# EAGLE schematic axiom_beta_plugin_module_TE0714_SDI_v0.10 (EAGLE 7.7.0)
Assembly variants: Beta, Min

## Sheet 1 of 6
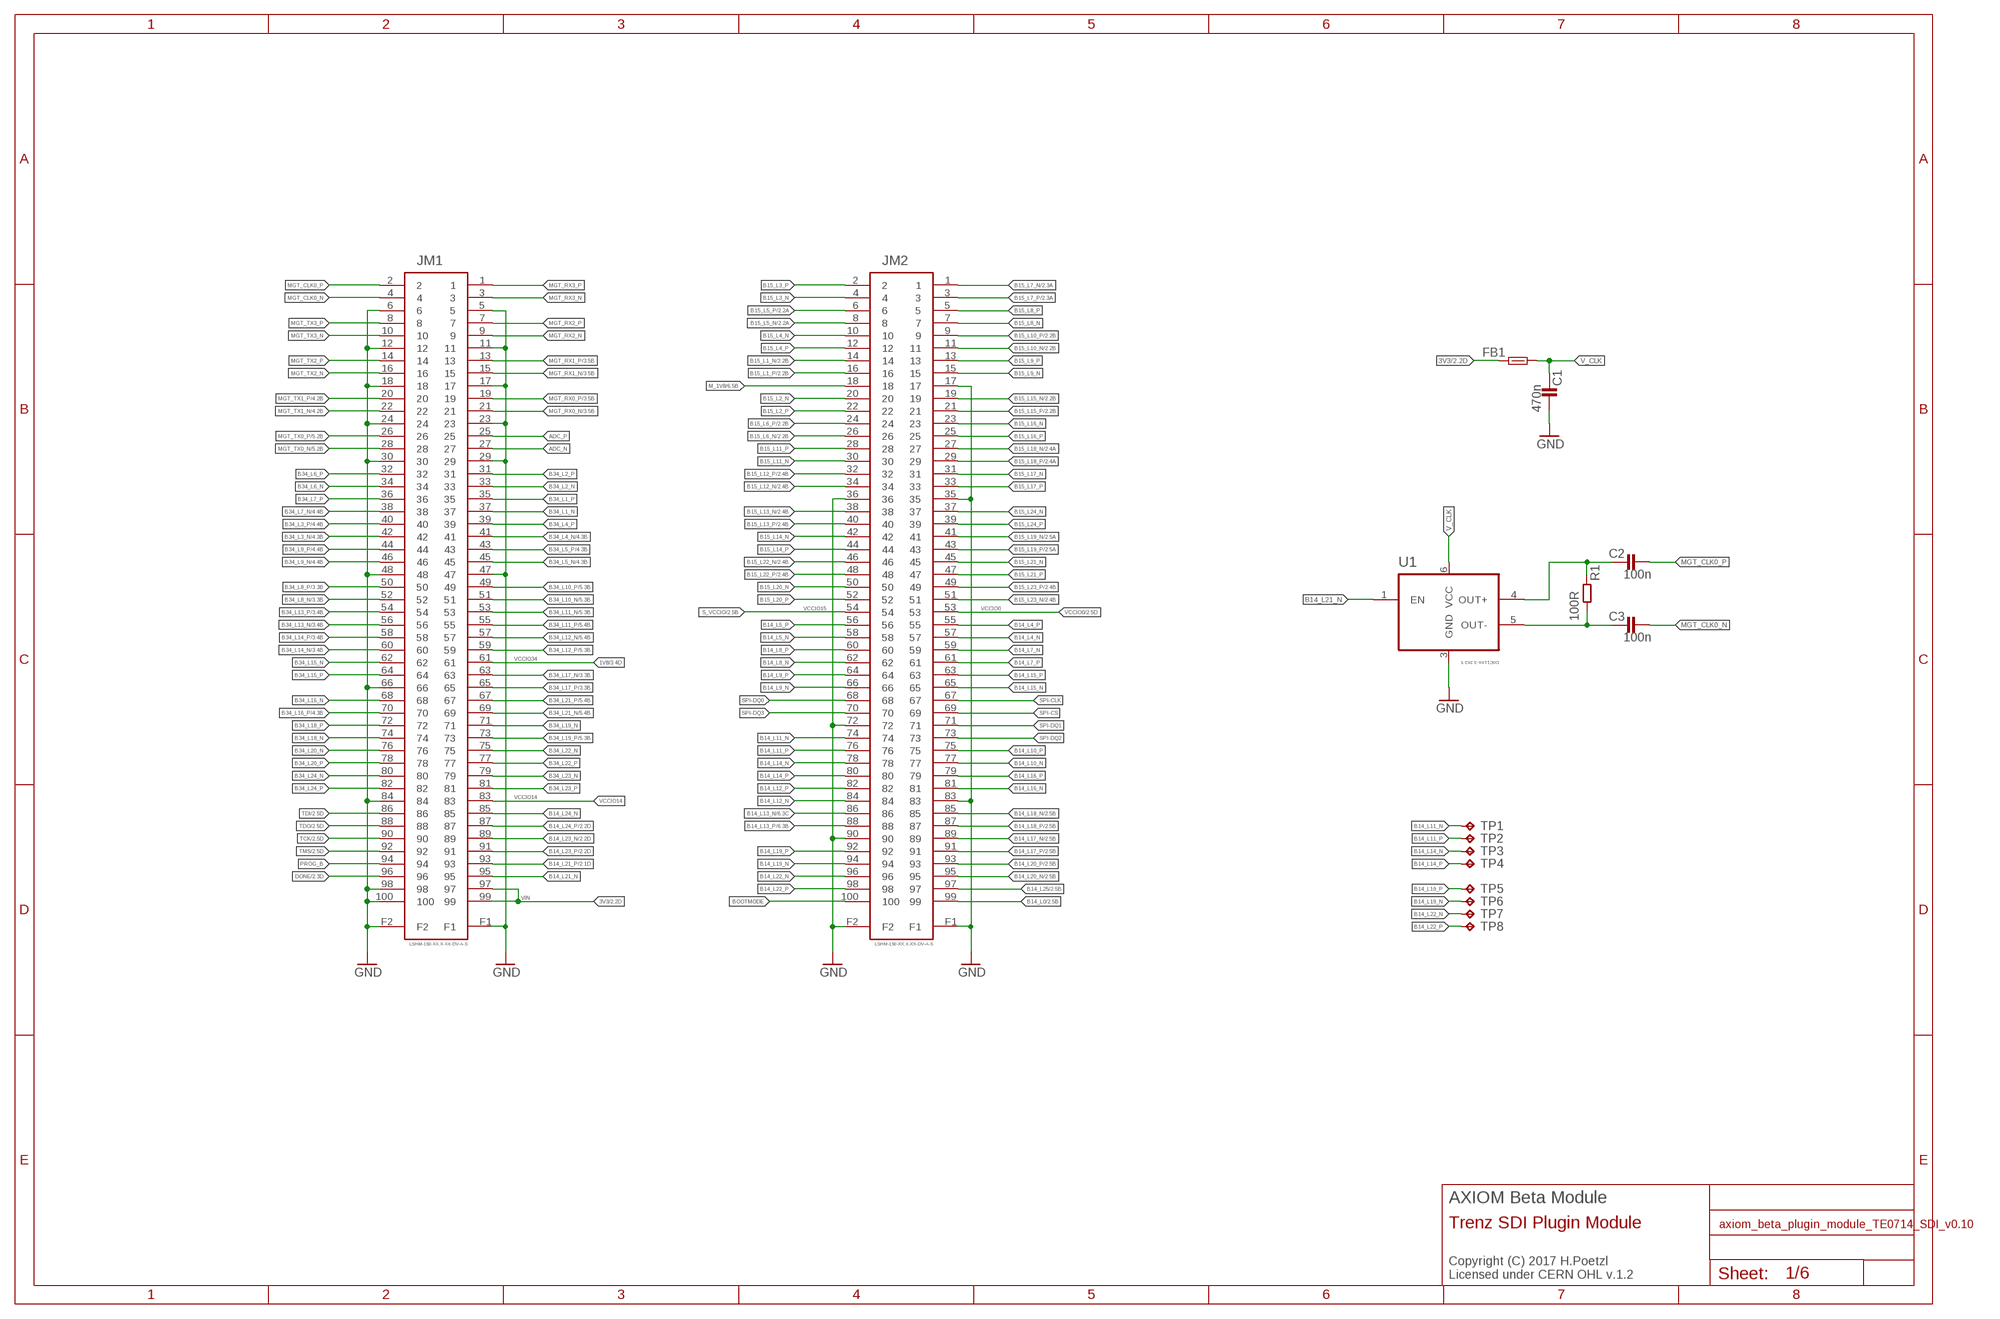
[diagram p0: schematic, sheet 1]

### Parts
C1  470n  C0402-C  [0402-C]
C2  100n  C0201-C  [0201-C]
C3  100n  C0201-C  [0201-C]
FB1  FB0402-C  [0402-C]
JM1  LSHM-150-XX.X-XX-DV-A-S  [LSHM-150-XX.X-XX-DV-A-S]
JM2  LSHM-150-XX.X-XX-DV-A-S  [LSHM-150-XX.X-XX-DV-A-S]
R1  100R  R0201-C  [0201-C]
TP1  TPTP08R  [TP08R]
TP2  TPTP08R  [TP08R]
TP3  TPTP08R  [TP08R]
TP4  TPTP08R  [TP08R]
TP5  TPTP10R  [TP10R]
TP6  TPTP10R  [TP10R]
TP7  TPTP10R  [TP10R]
TP8  TPTP10R  [TP10R]
U1  DSC11XX-3.2X2.5  [3.2X2.5]

### Nets
1V8 [LVDS]: JM1.61 ; also sheet 3,4,5,6
3V3 [LVDS]: FB1.1 JM1.97 JM1.99 ; also sheet 2,4,5,6
ADC_N: JM1.27
ADC_P: JM1.25
B14_L0: JM2.99 ; also sheet 2
B14_L4_N: JM2.57
B14_L4_P: JM2.55
B14_L5_N: JM2.58
B14_L5_P: JM2.56
B14_L7_N: JM2.59
B14_L7_P: JM2.61
B14_L8_N: JM2.62
B14_L8_P: JM2.60
B14_L9_N: JM2.66
B14_L9_P: JM2.64
B14_L10_N: JM2.77
B14_L10_P: JM2.75
B14_L11_N: JM2.74 TP1.TP
B14_L11_P: JM2.76 TP2.TP
B14_L12_N: JM2.84
B14_L12_P: JM2.82
B14_L13_N: JM2.86 ; also sheet 6
B14_L13_P: JM2.88 ; also sheet 6
B14_L14_N: JM2.78 TP3.TP
B14_L14_P: JM2.80 TP4.TP
B14_L15_N: JM2.65
B14_L15_P: JM2.63
B14_L16_N: JM2.81
B14_L16_P: JM2.79
B14_L17_N: JM2.89 ; also sheet 2
B14_L17_P: JM2.91 ; also sheet 2
B14_L18_N: JM2.85 ; also sheet 2
B14_L18_P: JM2.87 ; also sheet 2
B14_L19_N: JM2.94 TP6.TP
B14_L19_P: JM2.92 TP5.TP
B14_L20_N: JM2.95 ; also sheet 2
B14_L20_P: JM2.93 ; also sheet 2
B14_L21_N: JM1.95 U1.1(EN)
B14_L21_P: JM1.93 ; also sheet 2
B14_L22_N: JM2.96 TP7.TP
B14_L22_P: JM2.98 TP8.TP
B14_L23_N: JM1.89 ; also sheet 2
B14_L23_P: JM1.91 ; also sheet 2
B14_L24_N: JM1.85
B14_L24_P: JM1.87 ; also sheet 2
B14_L25: JM2.97 ; also sheet 2
B15_L1_N [LVDS]: JM2.14 ; also sheet 2
B15_L1_P [LVDS]: JM2.16 ; also sheet 2
B15_L2_N [LVDS]: JM2.20
B15_L2_P [LVDS]: JM2.22
B15_L3_N: JM2.4
B15_L3_P: JM2.2
B15_L4_N: JM2.10
B15_L4_P: JM2.12
B15_L5_N [LVDS]: JM2.8 ; also sheet 2
B15_L5_P [LVDS]: JM2.6 ; also sheet 2
B15_L6_N: JM2.26 ; also sheet 2
B15_L6_P: JM2.24 ; also sheet 2
B15_L7_N [LVDS]: JM2.1 ; also sheet 2
B15_L7_P [LVDS]: JM2.3 ; also sheet 2
B15_L8_N: JM2.7
B15_L8_P: JM2.5
B15_L9_N: JM2.15
B15_L9_P: JM2.13
B15_L10_N [LVDS]: JM2.11 ; also sheet 2
B15_L10_P [LVDS]: JM2.9 ; also sheet 2
B15_L11_N: JM2.30
B15_L11_P: JM2.28
B15_L12_N: JM2.34 ; also sheet 2
B15_L12_P: JM2.32 ; also sheet 2
B15_L13_N: JM2.38 ; also sheet 2
B15_L13_P: JM2.40 ; also sheet 2
B15_L14_N: JM2.42
B15_L14_P: JM2.44
B15_L15_N: JM2.19 ; also sheet 2
B15_L15_P: JM2.21 ; also sheet 2
B15_L16_N: JM2.23
B15_L16_P: JM2.25
B15_L17_N: JM2.31
B15_L17_P: JM2.33
B15_L18_N: JM2.27 ; also sheet 2
B15_L18_P: JM2.29 ; also sheet 2
B15_L19_N: JM2.41 ; also sheet 2
B15_L19_P: JM2.43 ; also sheet 2
B15_L20_N: JM2.50
B15_L20_P: JM2.52
B15_L21_N: JM2.45
B15_L21_P: JM2.47
B15_L22_N: JM2.46 ; also sheet 2
B15_L22_P: JM2.48 ; also sheet 2
B15_L23_N [LVDS]: JM2.51 ; also sheet 2
B15_L23_P [LVDS]: JM2.49 ; also sheet 2
B15_L24_N: JM2.37
B15_L24_P: JM2.39
B34_L1_N: JM1.37
B34_L1_P: JM1.35
B34_L2_N: JM1.33
B34_L2_P: JM1.31
B34_L3_N: JM1.42 ; also sheet 4
B34_L3_P: JM1.40 ; also sheet 4
B34_L4_N: JM1.41 ; also sheet 4
B34_L4_P: JM1.39
B34_L5_N: JM1.45 ; also sheet 4
B34_L5_P: JM1.43 ; also sheet 4
B34_L6_N: JM1.34
B34_L6_P: JM1.32
B34_L7_N: JM1.38 ; also sheet 4
B34_L7_P: JM1.36
B34_L8_N: JM1.52 ; also sheet 3
B34_L8_P: JM1.50 ; also sheet 3
B34_L9_N: JM1.46 ; also sheet 4
B34_L9_P: JM1.44 ; also sheet 4
B34_L10_N: JM1.51 ; also sheet 5
B34_L10_P: JM1.49 ; also sheet 5
B34_L11_N: JM1.53 ; also sheet 5
B34_L11_P: JM1.55 ; also sheet 5
B34_L12_N: JM1.57 ; also sheet 5
B34_L12_P: JM1.59 ; also sheet 5
B34_L13_N: JM1.56 ; also sheet 3
B34_L13_P: JM1.54 ; also sheet 3
B34_L14_N: JM1.60 ; also sheet 3
B34_L14_P: JM1.58 ; also sheet 3
B34_L15_N: JM1.62
B34_L15_P: JM1.64
B34_L16_N: JM1.68
B34_L16_P: JM1.70 ; also sheet 4
B34_L17_N: JM1.63 ; also sheet 3
B34_L17_P: JM1.65 ; also sheet 3
B34_L18_N: JM1.74
B34_L18_P: JM1.72
B34_L19_N: JM1.71
B34_L19_P: JM1.73 ; also sheet 5
B34_L20_N: JM1.76
B34_L20_P: JM1.78
B34_L21_N: JM1.69 ; also sheet 5
B34_L21_P: JM1.67 ; also sheet 5
B34_L22_N: JM1.75
B34_L22_P: JM1.77
B34_L23_N: JM1.79
B34_L23_P: JM1.81
B34_L24_N: JM1.80
B34_L24_P: JM1.82
BOOTMODE: JM2.100
DONE: JM1.96 ; also sheet 2
GND: C1.2 JM1.5 JM1.6 JM1.11 JM1.12 JM1.17 JM1.18 JM1.23 JM1.24 JM1.29 JM1.30 JM1.47 JM1.48 JM1.66 JM1.84 JM1.98 JM1.100 JM1.F1 JM1.F2 JM2.17 JM2.35 JM2.36 JM2.72 JM2.83 JM2.90 JM2.F1 JM2.F2 U1.3(GND) ; also sheet 2,3,4,5,6
M_1V8 [LVDS]: JM2.18 ; also sheet 6
MGT_CLK0_N [LVDS]: C3.2 JM1.4
MGT_CLK0_P [LVDS]: C2.2 JM1.2
MGT_RX0_N [MGT]: JM1.21 ; also sheet 3
MGT_RX0_P [MGT]: JM1.19 ; also sheet 3
MGT_RX1_N [MGT]: JM1.15 ; also sheet 3
MGT_RX1_P [MGT]: JM1.13 ; also sheet 3
MGT_RX2_N [MGT]: JM1.9
MGT_RX2_P [MGT]: JM1.7
MGT_RX3_N [MGT]: JM1.3
MGT_RX3_P [MGT]: JM1.1
MGT_TX0_N [MGT]: JM1.28 ; also sheet 5
MGT_TX0_P [MGT]: JM1.26 ; also sheet 5
MGT_TX1_N [MGT]: JM1.22 ; also sheet 4
MGT_TX1_P [MGT]: JM1.20 ; also sheet 4
MGT_TX2_N [MGT]: JM1.16
MGT_TX2_P [MGT]: JM1.14
MGT_TX3_N [MGT]: JM1.10
MGT_TX3_P [MGT]: JM1.8
OUT_N: C3.1 R1.2 U1.5(OUT-)
OUT_P: C2.1 R1.1 U1.4(OUT+)
PROG_B: JM1.94
S_VCCIO: JM2.54 ; also sheet 2
SPI-CLK: JM2.67
SPI-CS: JM2.69
SPI-DQ0: JM2.68
SPI-DQ1: JM2.71
SPI-DQ2: JM2.73
SPI-DQ3: JM2.70
TCK: JM1.90 ; also sheet 2
TDI: JM1.86 ; also sheet 2
TDO: JM1.88 ; also sheet 2
TMS: JM1.92 ; also sheet 2
V_CLK: C1.1 FB1.2 U1.6(VCC)
VCCIO0 [LVDS]: JM2.53 ; also sheet 2
VCCIO14 [LVDS]: JM1.83

### Notes on the sheet
- VCCIO15 | VCCIO0
- VCCIO34
- VCCIO14
- VIN
- AXIOM Beta Module
- Trenz SDI Plugin Module
- Copyright (C) 2017 H.Poetzl
  Licensed under CERN OHL v.1.2

## Sheet 2 of 6
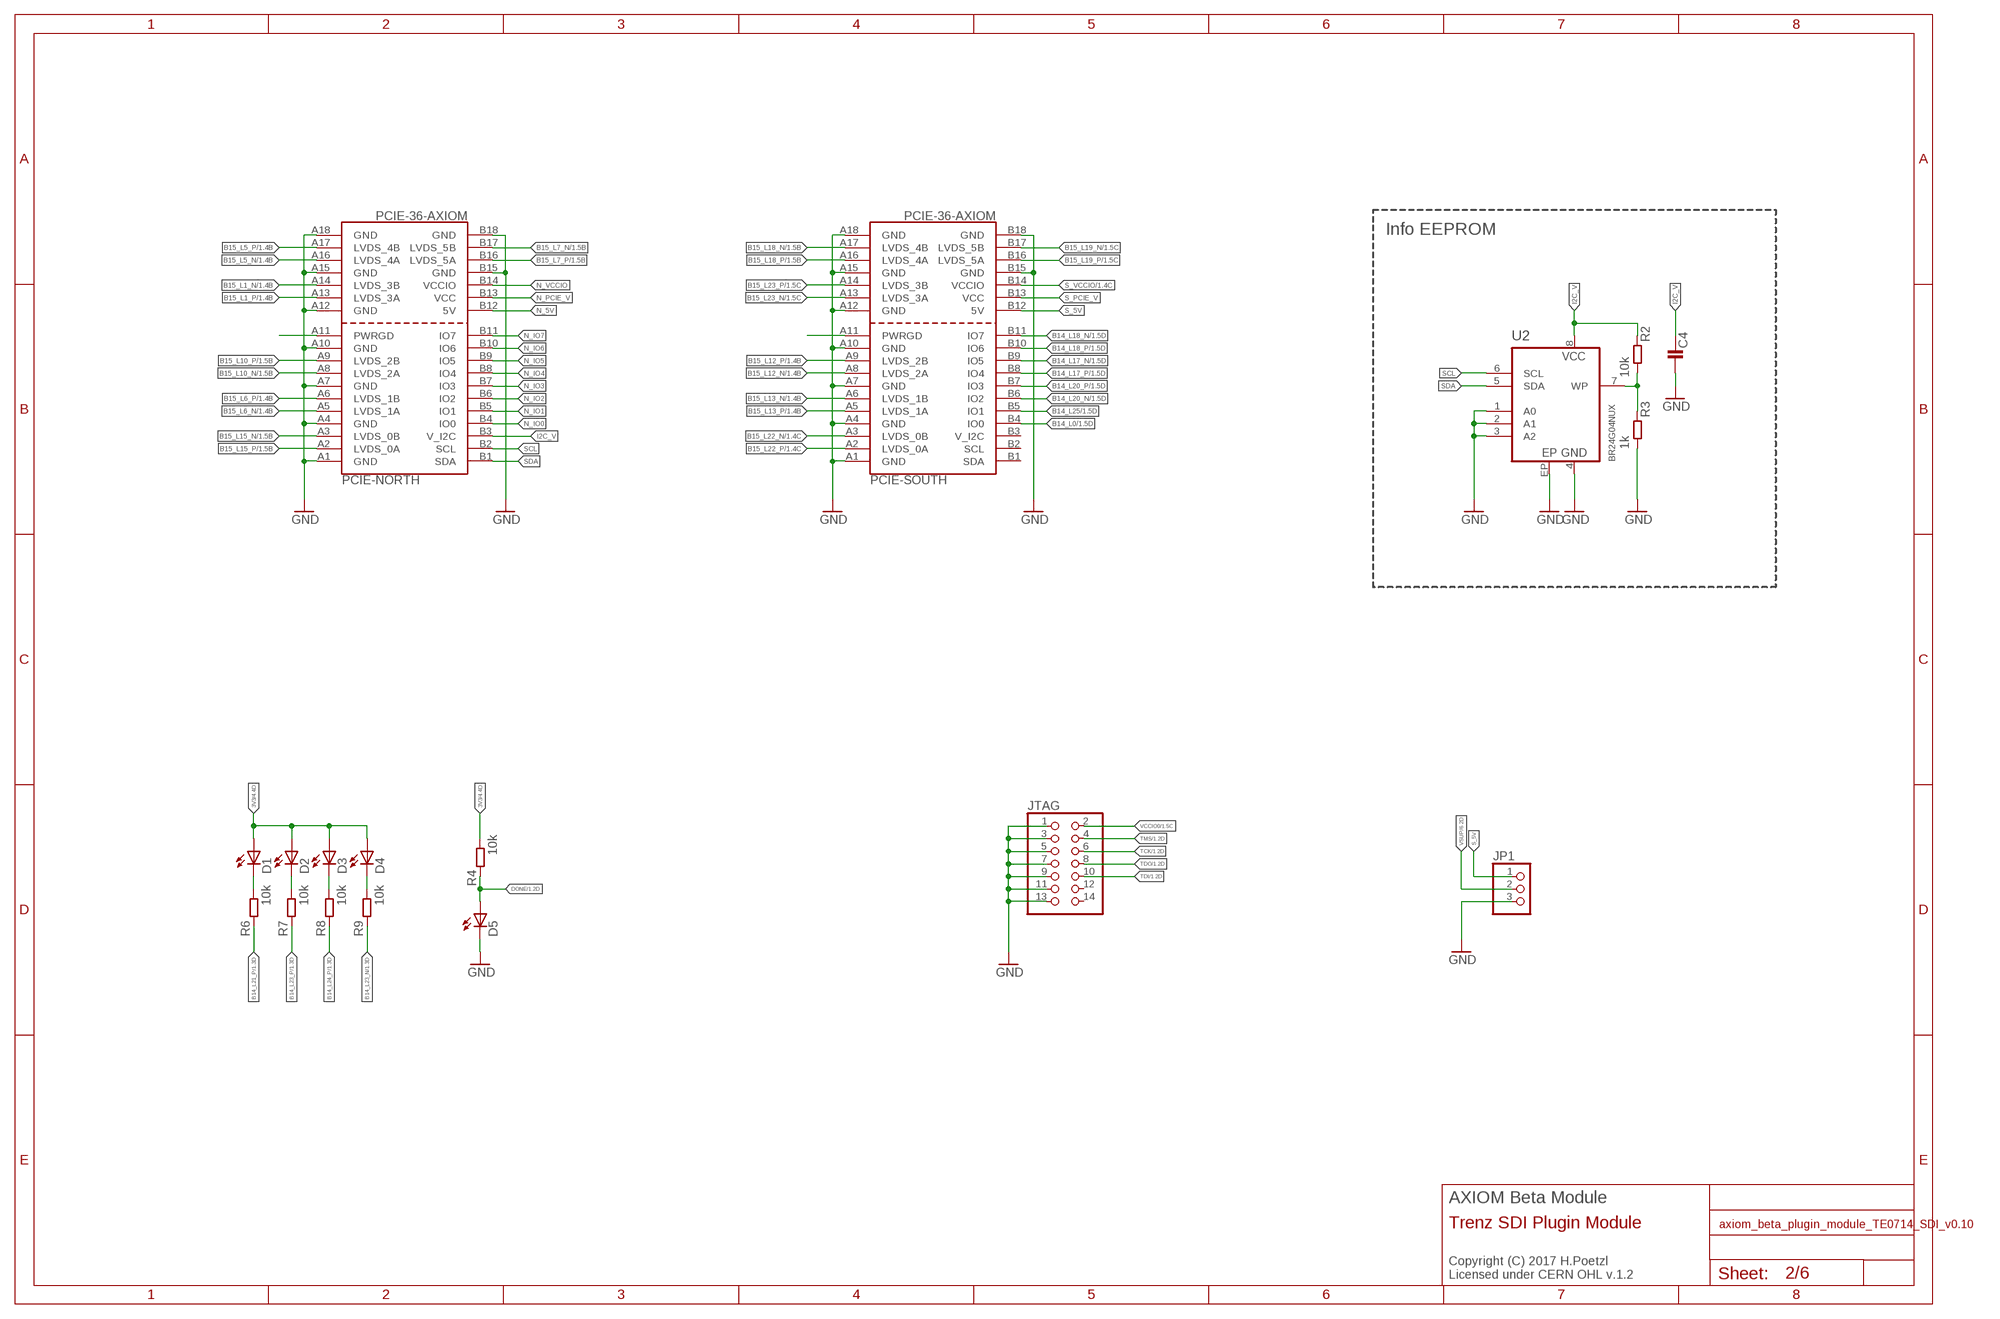
[diagram p1: schematic, sheet 2]

### Parts
C4  C0402-B  [0402-B]
D1  LED  [CHIPLED_0603]
D2  LED  [CHIPLED_0603]
D3  LED  [CHIPLED_0603]
D4  LED  [CHIPLED_0603]
D5  LED  [CHIPLED_0603]
JP1  PINHD-1X03_2.54-90°-S  [1X03/90-S]
JTAG  PINHD-2X07_2.00  [2X07M]
PCIE-NORTH  PCIE-36-AXIOM  [PCIE-36-AXIOM]  (not fitted in variant Beta)
PCIE-SOUTH  PCIE-36-AXIOM  [PCIE-36-AXIOM]  (not fitted in variant Beta)
R2  10k  R0402-B  [0402-B]
R3  1k  R0402-B  [0402-B]
R4  10k  R0402-C  [0402-C]
R6  10k  R0402-C  [0402-C]
R7  10k  R0402-C  [0402-C]
R8  10k  R0402-C  [0402-C]
R9  10k  R0402-C  [0402-C]
U2  BR24G04NUX  [DFN200X300X100-9N]

### Nets
3V3 [LVDS]: D1.A D2.A D3.A D4.A R4.2 ; also sheet 1,4,5,6
B14_L0: PCIE-SOUTH.B4(IO0) ; also sheet 1
B14_L17_N: PCIE-SOUTH.B9(IO5) ; also sheet 1
B14_L17_P: PCIE-SOUTH.B8(IO4) ; also sheet 1
B14_L18_N: PCIE-SOUTH.B11(IO7) ; also sheet 1
B14_L18_P: PCIE-SOUTH.B10(IO6) ; also sheet 1
B14_L20_N: PCIE-SOUTH.B6(IO2) ; also sheet 1
B14_L20_P: PCIE-SOUTH.B7(IO3) ; also sheet 1
B14_L21_P: R6.1 ; also sheet 1
B14_L23_N: R9.1 ; also sheet 1
B14_L23_P: R7.1 ; also sheet 1
B14_L24_P: R8.1 ; also sheet 1
B14_L25: PCIE-SOUTH.B5(IO1) ; also sheet 1
B15_L1_N [LVDS]: PCIE-NORTH.A14(LVDS_3B) ; also sheet 1
B15_L1_P [LVDS]: PCIE-NORTH.A13(LVDS_3A) ; also sheet 1
B15_L5_N [LVDS]: PCIE-NORTH.A16(LVDS_4A) ; also sheet 1
B15_L5_P [LVDS]: PCIE-NORTH.A17(LVDS_4B) ; also sheet 1
B15_L6_N: PCIE-NORTH.A5(LVDS_1A) ; also sheet 1
B15_L6_P: PCIE-NORTH.A6(LVDS_1B) ; also sheet 1
B15_L7_N [LVDS]: PCIE-NORTH.B17(LVDS_5B) ; also sheet 1
B15_L7_P [LVDS]: PCIE-NORTH.B16(LVDS_5A) ; also sheet 1
B15_L10_N [LVDS]: PCIE-NORTH.A8(LVDS_2A) ; also sheet 1
B15_L10_P [LVDS]: PCIE-NORTH.A9(LVDS_2B) ; also sheet 1
B15_L12_N: PCIE-SOUTH.A8(LVDS_2A) ; also sheet 1
B15_L12_P: PCIE-SOUTH.A9(LVDS_2B) ; also sheet 1
B15_L13_N: PCIE-SOUTH.A6(LVDS_1B) ; also sheet 1
B15_L13_P: PCIE-SOUTH.A5(LVDS_1A) ; also sheet 1
B15_L15_N: PCIE-NORTH.A3(LVDS_0B) ; also sheet 1
B15_L15_P: PCIE-NORTH.A2(LVDS_0A) ; also sheet 1
B15_L18_N: PCIE-SOUTH.A17(LVDS_4B) ; also sheet 1
B15_L18_P: PCIE-SOUTH.A16(LVDS_4A) ; also sheet 1
B15_L19_N: PCIE-SOUTH.B17(LVDS_5B) ; also sheet 1
B15_L19_P: PCIE-SOUTH.B16(LVDS_5A) ; also sheet 1
B15_L22_N: PCIE-SOUTH.A3(LVDS_0B) ; also sheet 1
B15_L22_P: PCIE-SOUTH.A2(LVDS_0A) ; also sheet 1
B15_L23_N [LVDS]: PCIE-SOUTH.A13(LVDS_3A) ; also sheet 1
B15_L23_P [LVDS]: PCIE-SOUTH.A14(LVDS_3B) ; also sheet 1
DONE: D5.A R4.1 ; also sheet 1
GND: C4.2 D5.C JP1.3 JTAG.1 JTAG.3 JTAG.5 JTAG.7 JTAG.9 JTAG.11 JTAG.13 PCIE-NORTH.A1(GND) PCIE-NORTH.A4(GND) PCIE-NORTH.A7(GND) PCIE-NORTH.A10(GND) PCIE-NORTH.A12(GND) PCIE-NORTH.A15(GND) PCIE-NORTH.A18(GND) PCIE-NORTH.B15(GND) PCIE-NORTH.B18(GND) PCIE-SOUTH.A1(GND) PCIE-SOUTH.A4(GND) PCIE-SOUTH.A7(GND) PCIE-SOUTH.A10(GND) PCIE-SOUTH.A12(GND) PCIE-SOUTH.A15(GND) PCIE-SOUTH.A18(GND) PCIE-SOUTH.B15(GND) PCIE-SOUTH.B18(GND) R3.2 U2.1(A0) U2.2(A1) U2.3(A2) U2.4(GND) U2.EP ; also sheet 1,3,4,5,6
I2C_V: C4.1 PCIE-NORTH.B3(V_I2C) R2.1 U2.8(VCC)
N$1 [LVDS]: D1.C R6.2
N$2 [LVDS]: D2.C R7.2
N$3 [LVDS]: D3.C R8.2
N$4 [LVDS]: D4.C R9.2
N$209: PCIE-NORTH.A11(PWRGD)
N$216: R2.2 R3.1 U2.7(WP)
N$256: PCIE-SOUTH.A11(PWRGD)
N_5V: PCIE-NORTH.B12(5V)
N_IO0: PCIE-NORTH.B4(IO0)
N_IO1: PCIE-NORTH.B5(IO1)
N_IO2: PCIE-NORTH.B6(IO2)
N_IO3: PCIE-NORTH.B7(IO3)
N_IO4 [LVDS]: PCIE-NORTH.B8(IO4)
N_IO5 [LVDS]: PCIE-NORTH.B9(IO5)
N_IO6: PCIE-NORTH.B10(IO6)
N_IO7: PCIE-NORTH.B11(IO7)
N_PCIE_V: PCIE-NORTH.B13(VCC)
N_VCCIO: PCIE-NORTH.B14(VCCIO)
S_5V: JP1.1 PCIE-SOUTH.B12(5V)
S_PCIE_V: PCIE-SOUTH.B13(VCC)
S_VCCIO: PCIE-SOUTH.B14(VCCIO) ; also sheet 1
SCL: PCIE-NORTH.B2(SCL) U2.6(SCL)
SDA: PCIE-NORTH.B1(SDA) U2.5(SDA)
TCK: JTAG.6 ; also sheet 1
TDI: JTAG.10 ; also sheet 1
TDO: JTAG.8 ; also sheet 1
TMS: JTAG.4 ; also sheet 1
VCCIO0 [LVDS]: JTAG.2 ; also sheet 1
VSUP [LVDS]: JP1.2 ; also sheet 6
Unconnected: JTAG.12 JTAG.14 PCIE-SOUTH.B1(SDA) PCIE-SOUTH.B2(SCL) PCIE-SOUTH.B3(V_I2C)

### Notes on the sheet
- Info EEPROM
- AXIOM Beta Module
- Trenz SDI Plugin Module
- Copyright (C) 2017 H.Poetzl
  Licensed under CERN OHL v.1.2

## Sheet 3 of 6
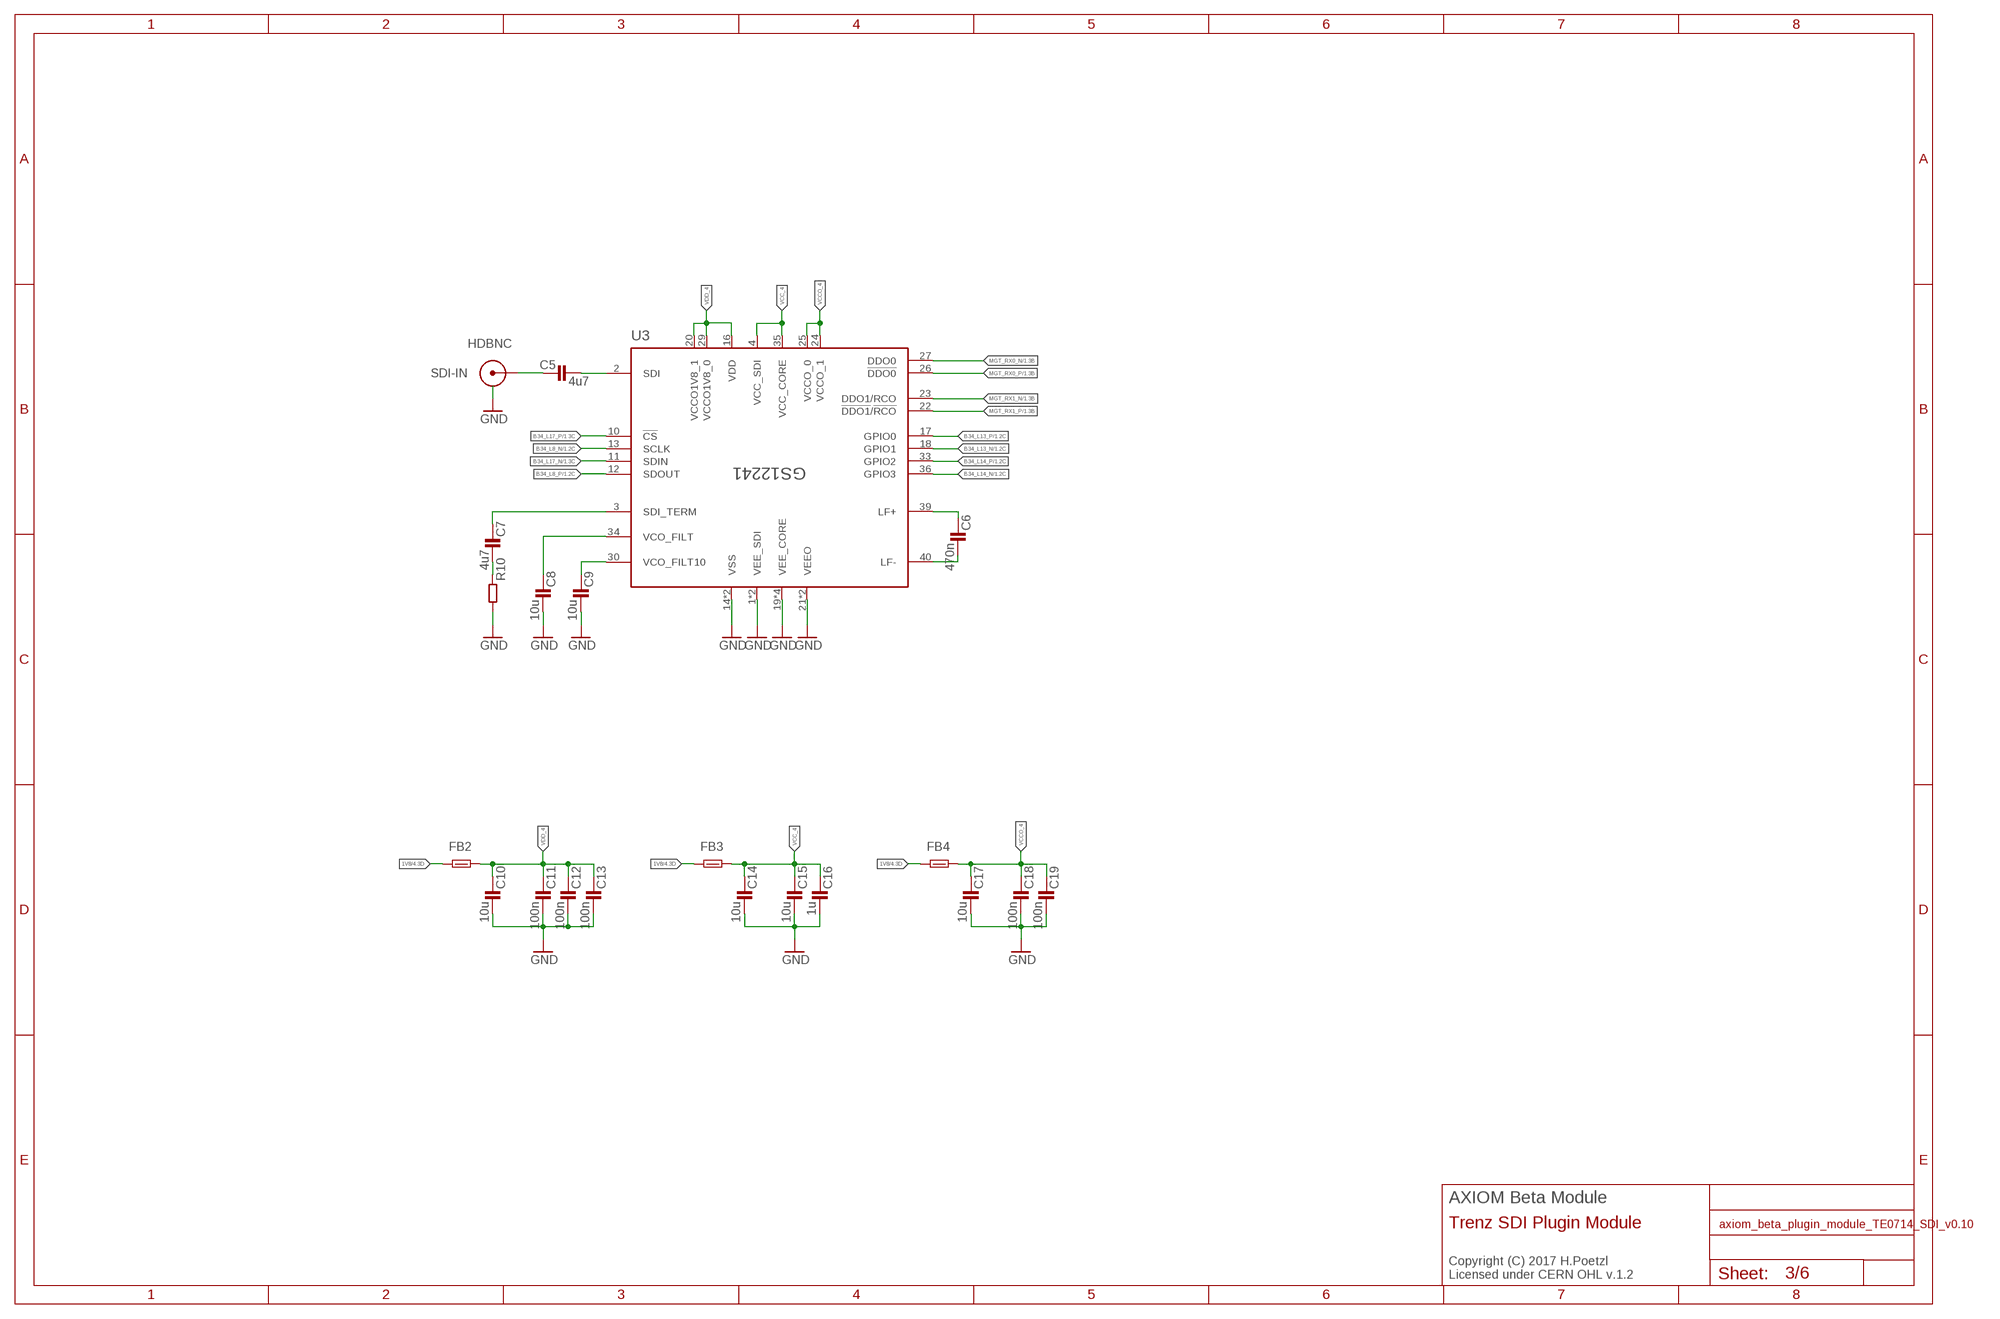
[diagram p2: schematic, sheet 3]

### Parts
C5  4u7  C0402-C  [0402-C]
C6  470n  C0201-C  [0201-C]
C7  4u7  C0402-C  [0402-C]
C8  10u  C0402-C  [0402-C]
C9  10u  C0402-C  [0402-C]
C10  10u  C0402-C  [0402-C]
C11  100n  C0201-C  [0201-C]
C12  100n  C0201-C  [0201-C]
C13  100n  C0201-C  [0201-C]
C14  10u  C0402-C  [0402-C]
C15  10u  C0402-C  [0402-C]
C16  1u  C0201-C  [0201-C]
C17  10u  C0402-C  [0402-C]
C18  100n  C0201-C  [0201-C]
C19  100n  C0201-C  [0201-C]
FB2  FB0402-C  [0402-C]
FB3  FB0402-C  [0402-C]
FB4  FB0402-C  [0402-C]
R10  R0201-C  [0201-C]
SDI-IN  HDBNC  [HDBNC_EDGE_2SIDE]
U3  GS12241  [UQFN40P600X400X100-41N]

### Nets
1V8 [LVDS]: FB2.1 FB3.1 FB4.1 ; also sheet 1,4,5,6
B34_L8_N: U3.13(SCLK) ; also sheet 1
B34_L8_P: U3.12(SDOUT) ; also sheet 1
B34_L13_N: U3.18(GPIO1) ; also sheet 1
B34_L13_P: U3.17(GPIO0) ; also sheet 1
B34_L14_N: U3.36(GPIO3) ; also sheet 1
B34_L14_P: U3.33(GPIO2) ; also sheet 1
B34_L17_N: U3.11(SDIN) ; also sheet 1
B34_L17_P: U3.10(!CS) ; also sheet 1
GND: C8.2 C9.2 C10.2 C11.2 C12.2 C13.2 C14.2 C15.2 C16.2 C17.2 C18.2 C19.2 R10.2 SDI-IN.2@1(GND) SDI-IN.2@2(GND) SDI-IN.2@3(GND) U3.1(VEE_SDI) U3.8(VEE_SDI) U3.14(VSS) U3.15(VSS) U3.19(VEE_CORE) U3.21(VEEO) U3.28(VEEO) U3.31(VEE_CORE) U3.37(VEE_CORE) U3.38(VEE_CORE) ; also sheet 1,2,4,5,6
MGT_RX0_N [MGT]: U3.27(DDO0) ; also sheet 1
MGT_RX0_P [MGT]: U3.26(!DDO0) ; also sheet 1
MGT_RX1_N [MGT]: U3.23(DDO1/RCO) ; also sheet 1
MGT_RX1_P [MGT]: U3.22(!DDO1!/!RCO) ; also sheet 1
N$7: C6.2 U3.40(LF-)
N$8: C6.1 U3.39(LF+)
N$11: C9.1 U3.30(VCO_FILT10)
N$12: C8.1 U3.34(VCO_FILT)
N$19: C7.2 R10.1
N$20: C7.1 U3.3(SDI_TERM)
N$37 [75Ohm]: C5.2 U3.2(SDI)
N$38: C5.1 SDI-IN.1
VCC_4: C14.1 C15.1 C16.1 FB3.2 U3.4(VCC_SDI) U3.35(VCC_CORE)
VCCO_4: C17.1 C18.1 C19.1 FB4.2 U3.24(VCCO_1) U3.25(VCCO_0)
VDD_4: C10.1 C11.1 C12.1 C13.1 FB2.2 U3.16(VDD) U3.20(VCCO1V8_1) U3.29(VCCO1V8_0)

### Notes on the sheet
- AXIOM Beta Module
- Trenz SDI Plugin Module
- Copyright (C) 2017 H.Poetzl
  Licensed under CERN OHL v.1.2

## Sheet 4 of 6
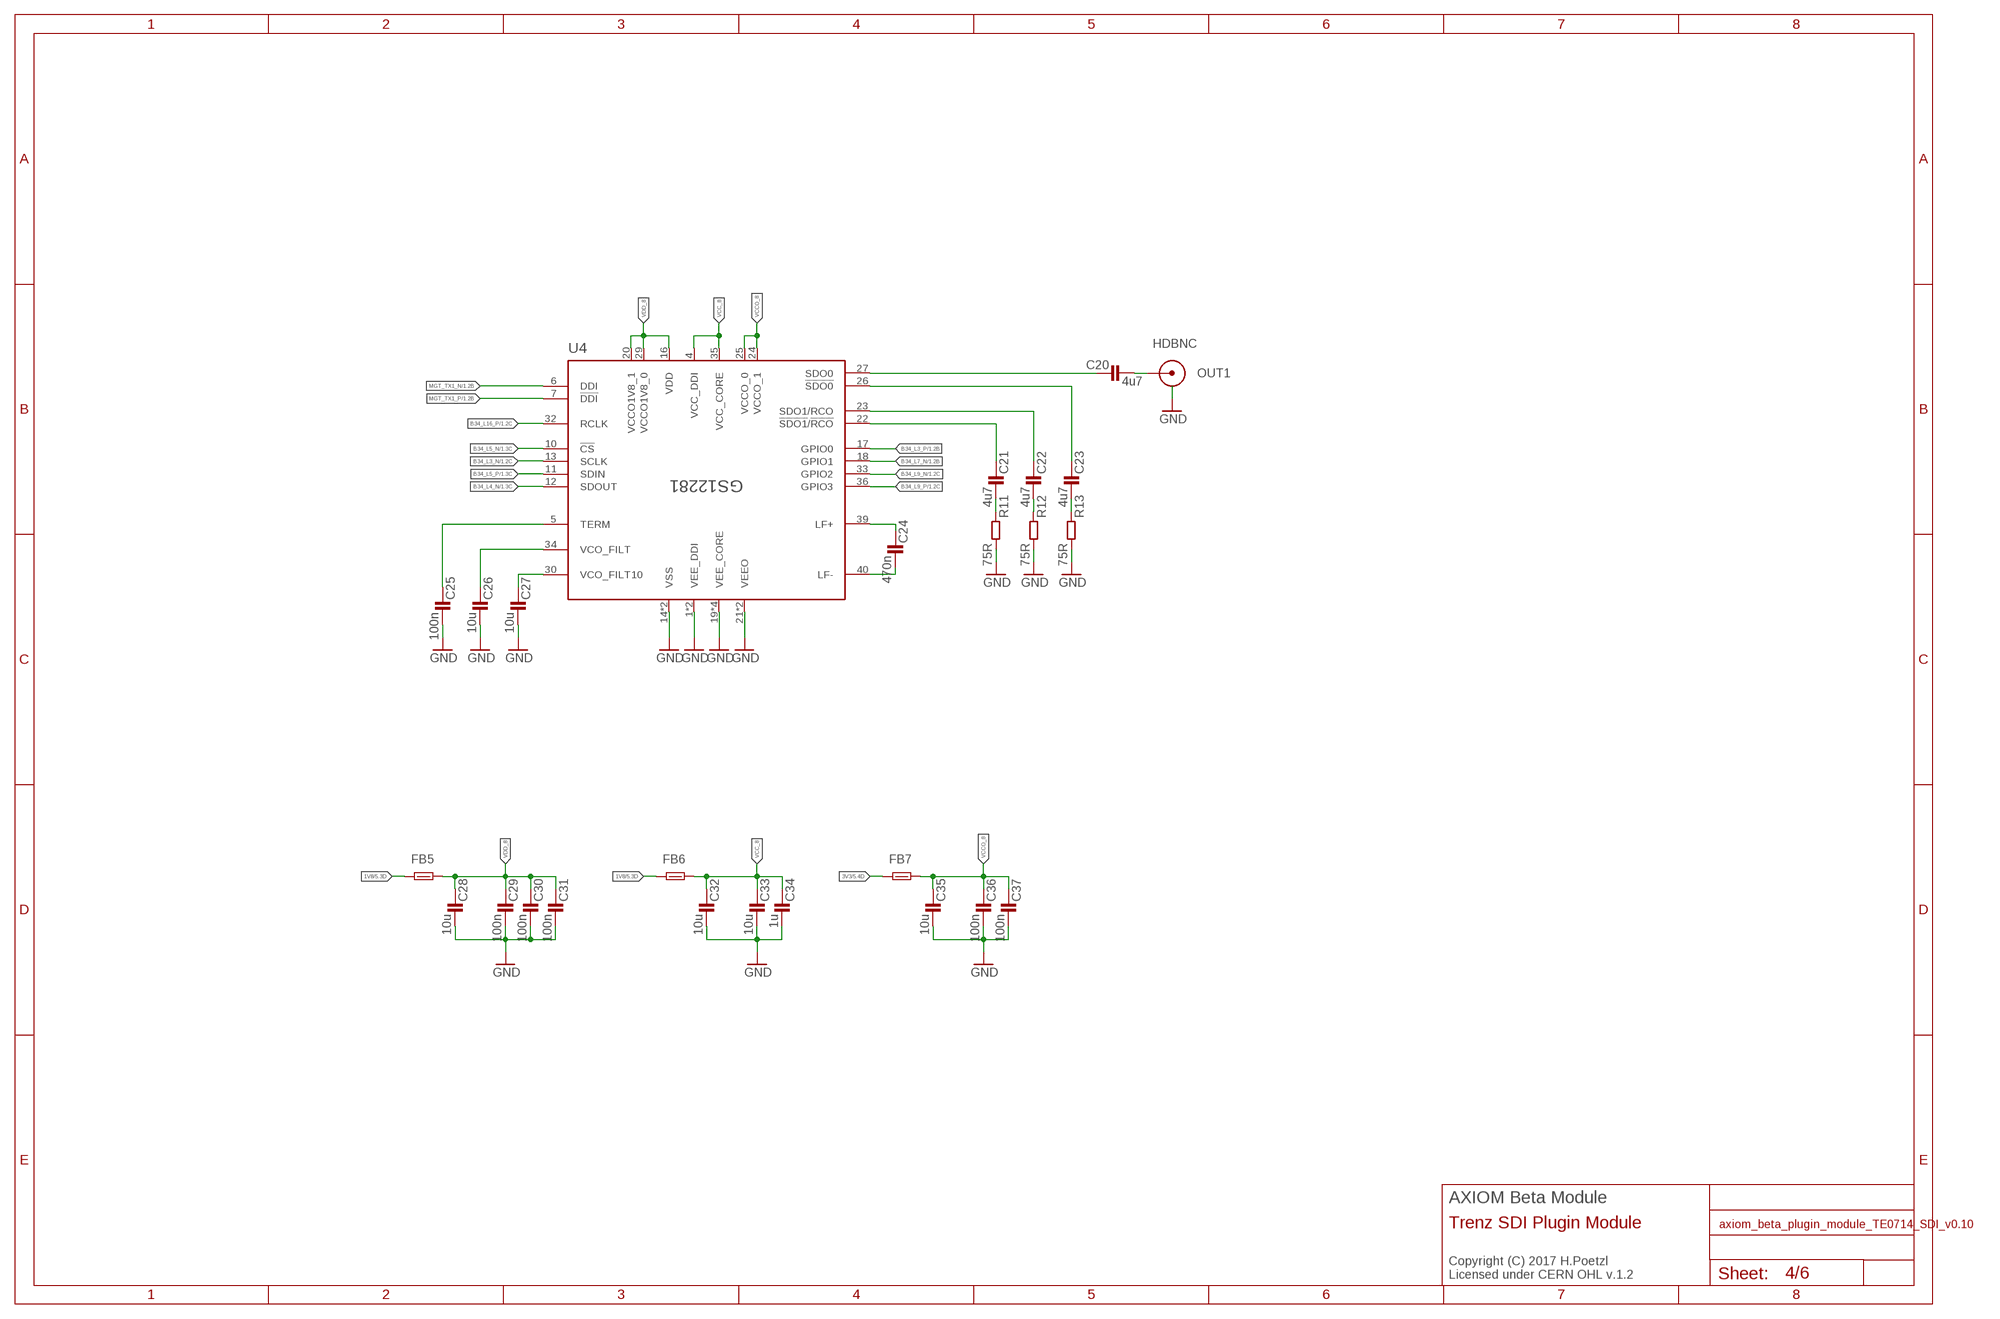
[diagram p3: schematic, sheet 4]

### Parts
C20  4u7  C0402-C  [0402-C]
C21  4u7  C0402-C  [0402-C]
C22  4u7  C0402-C  [0402-C]
C23  4u7  C0402-C  [0402-C]
C24  470n  C0201-C  [0201-C]
C25  100n  C0201-C  [0201-C]
C26  10u  C0402-C  [0402-C]
C27  10u  C0402-C  [0402-C]
C28  10u  C0402-C  [0402-C]
C29  100n  C0201-C  [0201-C]
C30  100n  C0201-C  [0201-C]
C31  100n  C0201-C  [0201-C]
C32  10u  C0402-C  [0402-C]
C33  10u  C0402-C  [0402-C]
C34  1u  C0201-C  [0201-C]
C35  10u  C0402-C  [0402-C]
C36  100n  C0201-C  [0201-C]
C37  100n  C0201-C  [0201-C]
FB5  FB0402-C  [0402-C]
FB6  FB0402-C  [0402-C]
FB7  FB0402-C  [0402-C]
OUT1  HDBNC  [HDBNC_EDGE_2SIDE]
R11  75R  R0201-C  [0201-C]
R12  75R  R0201-C  [0201-C]
R13  75R  R0201-C  [0201-C]
U4  GS12281  [UQFN40P600X400X100-41N]

### Nets
1V8 [LVDS]: FB5.1 FB6.1 ; also sheet 1,3,5,6
3V3 [LVDS]: FB7.1 ; also sheet 1,2,5,6
B34_L3_N: U4.13(SCLK) ; also sheet 1
B34_L3_P: U4.17(GPIO0) ; also sheet 1
B34_L4_N: U4.12(SDOUT) ; also sheet 1
B34_L5_N: U4.10(!CS) ; also sheet 1
B34_L5_P: U4.11(SDIN) ; also sheet 1
B34_L7_N: U4.18(GPIO1) ; also sheet 1
B34_L9_N: U4.33(GPIO2) ; also sheet 1
B34_L9_P: U4.36(GPIO3) ; also sheet 1
B34_L16_P: U4.32(RCLK) ; also sheet 1
GND: C25.2 C26.2 C27.2 C28.2 C29.2 C30.2 C31.2 C32.2 C33.2 C34.2 C35.2 C36.2 C37.2 OUT1.2@1(GND) OUT1.2@2(GND) OUT1.2@3(GND) R11.2 R12.2 R13.2 U4.1(VEE_DDI) U4.8(VEE_DDI) U4.14(VSS) U4.15(VSS) U4.19(VEE_CORE) U4.21(VEEO) U4.28(VEEO) U4.31(VEE_CORE) U4.37(VEE_CORE) U4.38(VEE_CORE) ; also sheet 1,2,3,5,6
MGT_TX1_N [MGT]: U4.6(DDI) ; also sheet 1
MGT_TX1_P [MGT]: U4.7(!DDI) ; also sheet 1
N$9: C24.2 U4.40(LF-)
N$10: C24.1 U4.39(LF+)
N$13: C21.2 R11.1
N$14: C21.1 U4.22(!SDO1!/!RCO)
N$15 [75Ohm]: C22.1 U4.23(SDO1/RCO)
N$16: C22.2 R12.1
N$17: C23.1 U4.26(!SDO0)
N$18: C23.2 R13.1
N$21: C27.1 U4.30(VCO_FILT10)
N$22: C26.1 U4.34(VCO_FILT)
N$23 [75Ohm]: C20.1 U4.27(SDO0)
N$24: C25.1 U4.5(TERM)
N$25: C20.2 OUT1.1
VCC_8: C32.1 C33.1 C34.1 FB6.2 U4.4(VCC_DDI) U4.35(VCC_CORE)
VCCO_8: C35.1 C36.1 C37.1 FB7.2 U4.24(VCCO_1) U4.25(VCCO_0)
VDD_8: C28.1 C29.1 C30.1 C31.1 FB5.2 U4.16(VDD) U4.20(VCCO1V8_1) U4.29(VCCO1V8_0)

### Notes on the sheet
- AXIOM Beta Module
- Trenz SDI Plugin Module
- Copyright (C) 2017 H.Poetzl
  Licensed under CERN OHL v.1.2

## Sheet 5 of 6
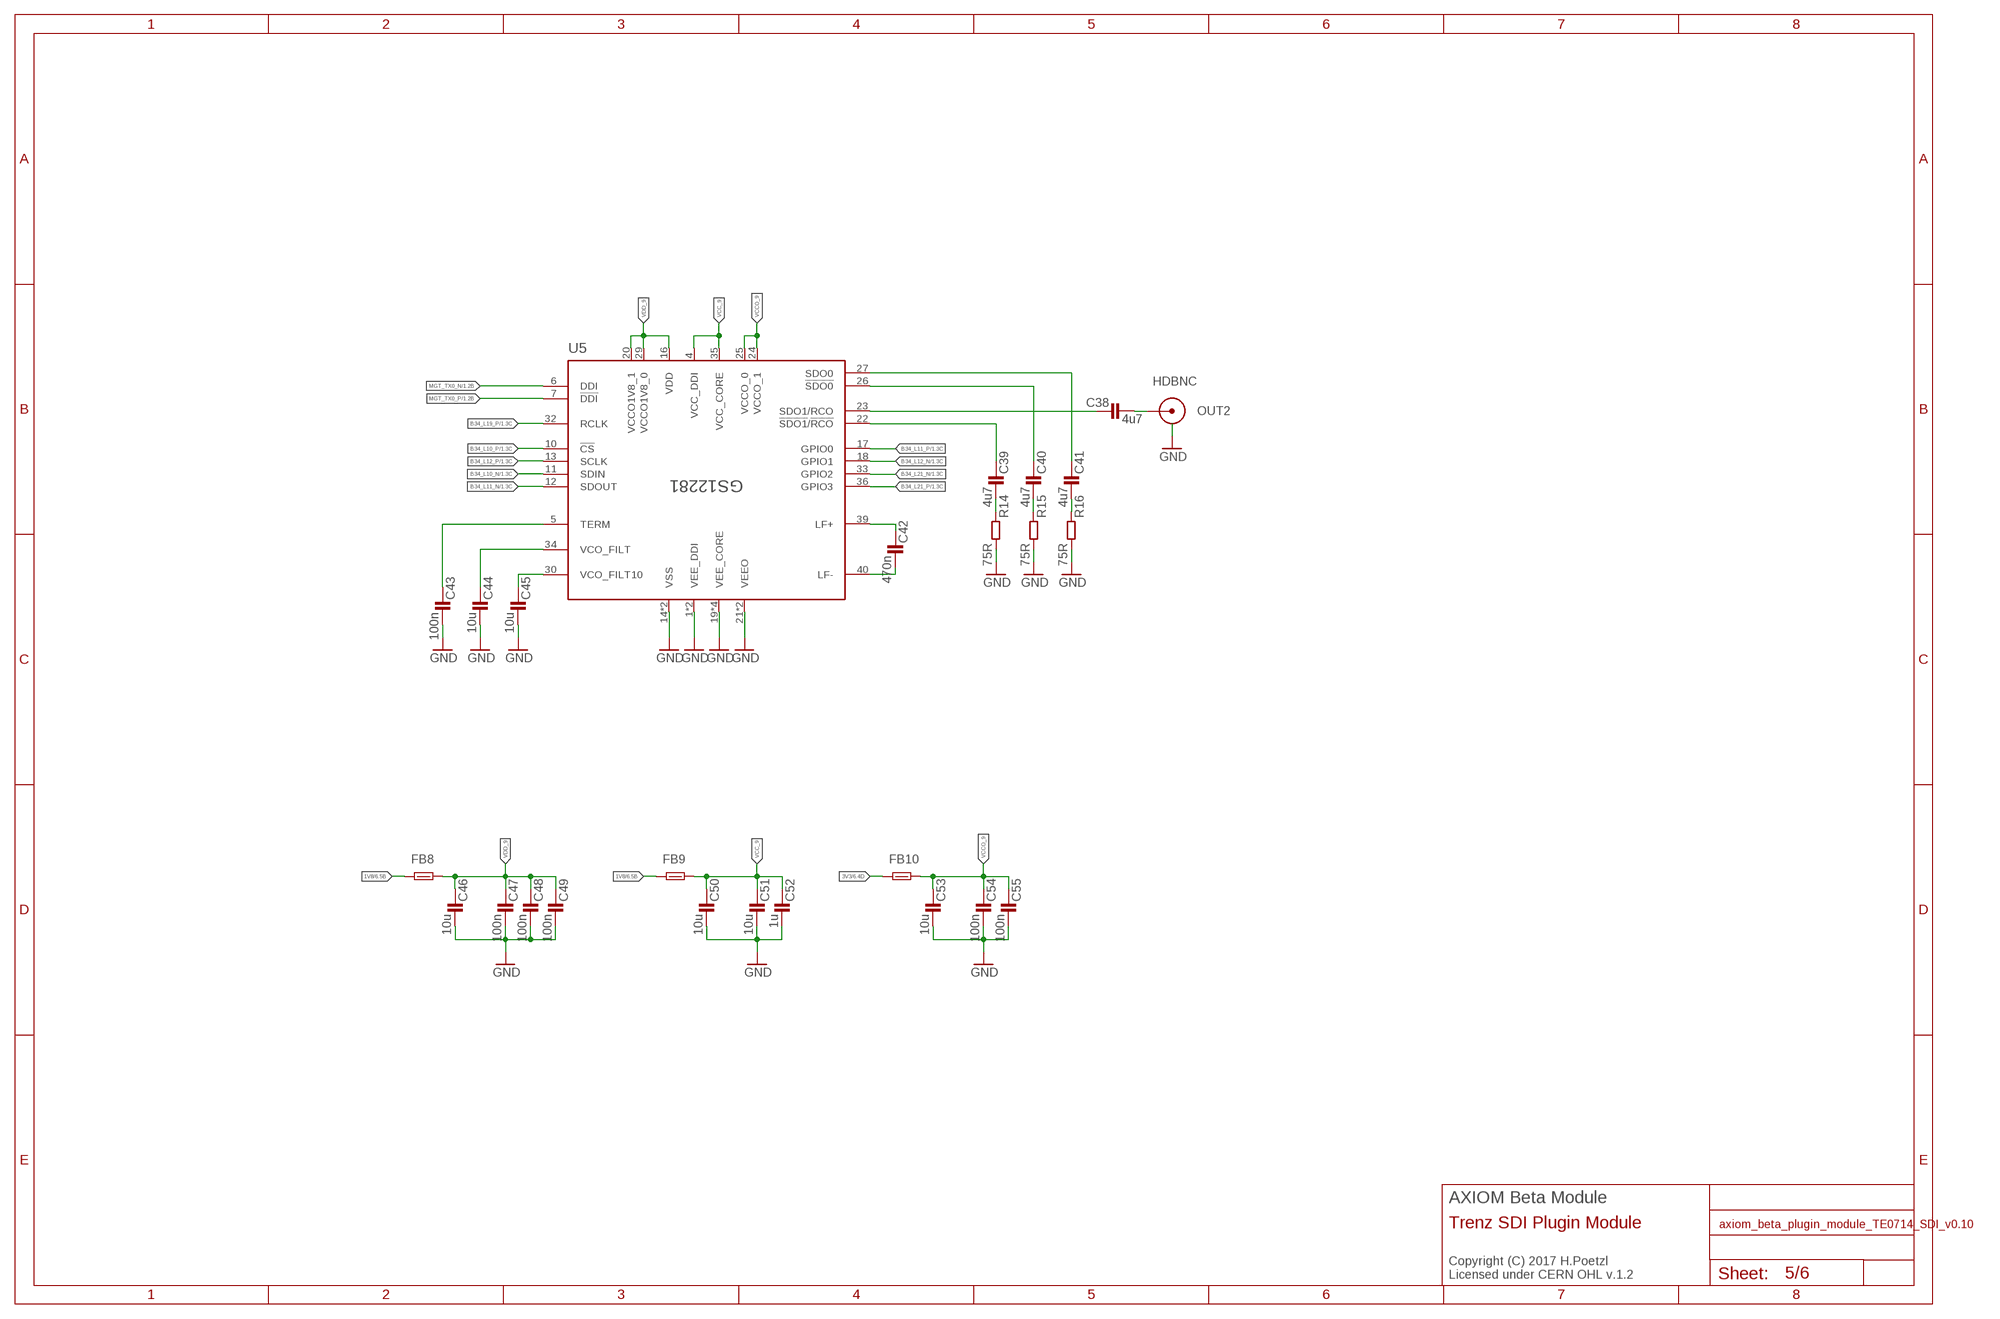
[diagram p4: schematic, sheet 5]

### Parts
C38  4u7  C0402-C  [0402-C]
C39  4u7  C0402-C  [0402-C]
C40  4u7  C0402-C  [0402-C]
C41  4u7  C0402-C  [0402-C]
C42  470n  C0201-C  [0201-C]
C43  100n  C0201-C  [0201-C]
C44  10u  C0402-C  [0402-C]
C45  10u  C0402-C  [0402-C]
C46  10u  C0402-C  [0402-C]
C47  100n  C0201-C  [0201-C]
C48  100n  C0201-C  [0201-C]
C49  100n  C0201-C  [0201-C]
C50  10u  C0402-C  [0402-C]
C51  10u  C0402-C  [0402-C]
C52  1u  C0201-C  [0201-C]
C53  10u  C0402-C  [0402-C]
C54  100n  C0201-C  [0201-C]
C55  100n  C0201-C  [0201-C]
FB8  FB0402-C  [0402-C]
FB9  FB0402-C  [0402-C]
FB10  FB0402-C  [0402-C]
OUT2  HDBNC  [HDBNC_EDGE_2SIDE]
R14  75R  R0201-C  [0201-C]
R15  75R  R0201-C  [0201-C]
R16  75R  R0201-C  [0201-C]
U5  GS12281  [UQFN40P600X400X100-41N]

### Nets
1V8 [LVDS]: FB8.1 FB9.1 ; also sheet 1,3,4,6
3V3 [LVDS]: FB10.1 ; also sheet 1,2,4,6
B34_L10_N: U5.11(SDIN) ; also sheet 1
B34_L10_P: U5.10(!CS) ; also sheet 1
B34_L11_N: U5.12(SDOUT) ; also sheet 1
B34_L11_P: U5.17(GPIO0) ; also sheet 1
B34_L12_N: U5.18(GPIO1) ; also sheet 1
B34_L12_P: U5.13(SCLK) ; also sheet 1
B34_L19_P: U5.32(RCLK) ; also sheet 1
B34_L21_N: U5.33(GPIO2) ; also sheet 1
B34_L21_P: U5.36(GPIO3) ; also sheet 1
GND: C43.2 C44.2 C45.2 C46.2 C47.2 C48.2 C49.2 C50.2 C51.2 C52.2 C53.2 C54.2 C55.2 OUT2.2@1(GND) OUT2.2@2(GND) OUT2.2@3(GND) R14.2 R15.2 R16.2 U5.1(VEE_DDI) U5.8(VEE_DDI) U5.14(VSS) U5.15(VSS) U5.19(VEE_CORE) U5.21(VEEO) U5.28(VEEO) U5.31(VEE_CORE) U5.37(VEE_CORE) U5.38(VEE_CORE) ; also sheet 1,2,3,4,6
MGT_TX0_N [MGT]: U5.6(DDI) ; also sheet 1
MGT_TX0_P [MGT]: U5.7(!DDI) ; also sheet 1
N$35 [75Ohm]: C38.1 U5.23(SDO1/RCO)
N$59: C38.2 OUT2.1
N$78: C42.2 U5.40(LF-)
N$90: C43.1 U5.5(TERM)
N$91: C44.1 U5.34(VCO_FILT)
N$92: C45.1 U5.30(VCO_FILT10)
N$93: C40.2 R15.1
N$94: C40.1 U5.26(!SDO0)
N$95: C41.2 R16.1
N$96: C41.1 U5.27(SDO0)
N$97: C39.1 U5.22(!SDO1!/!RCO)
N$98: C39.2 R14.1
N$99: C42.1 U5.39(LF+)
VCC_9: C50.1 C51.1 C52.1 FB9.2 U5.4(VCC_DDI) U5.35(VCC_CORE)
VCCO_9: C53.1 C54.1 C55.1 FB10.2 U5.24(VCCO_1) U5.25(VCCO_0)
VDD_9: C46.1 C47.1 C48.1 C49.1 FB8.2 U5.16(VDD) U5.20(VCCO1V8_1) U5.29(VCCO1V8_0)

### Notes on the sheet
- AXIOM Beta Module
- Trenz SDI Plugin Module
- Copyright (C) 2017 H.Poetzl
  Licensed under CERN OHL v.1.2

## Sheet 6 of 6
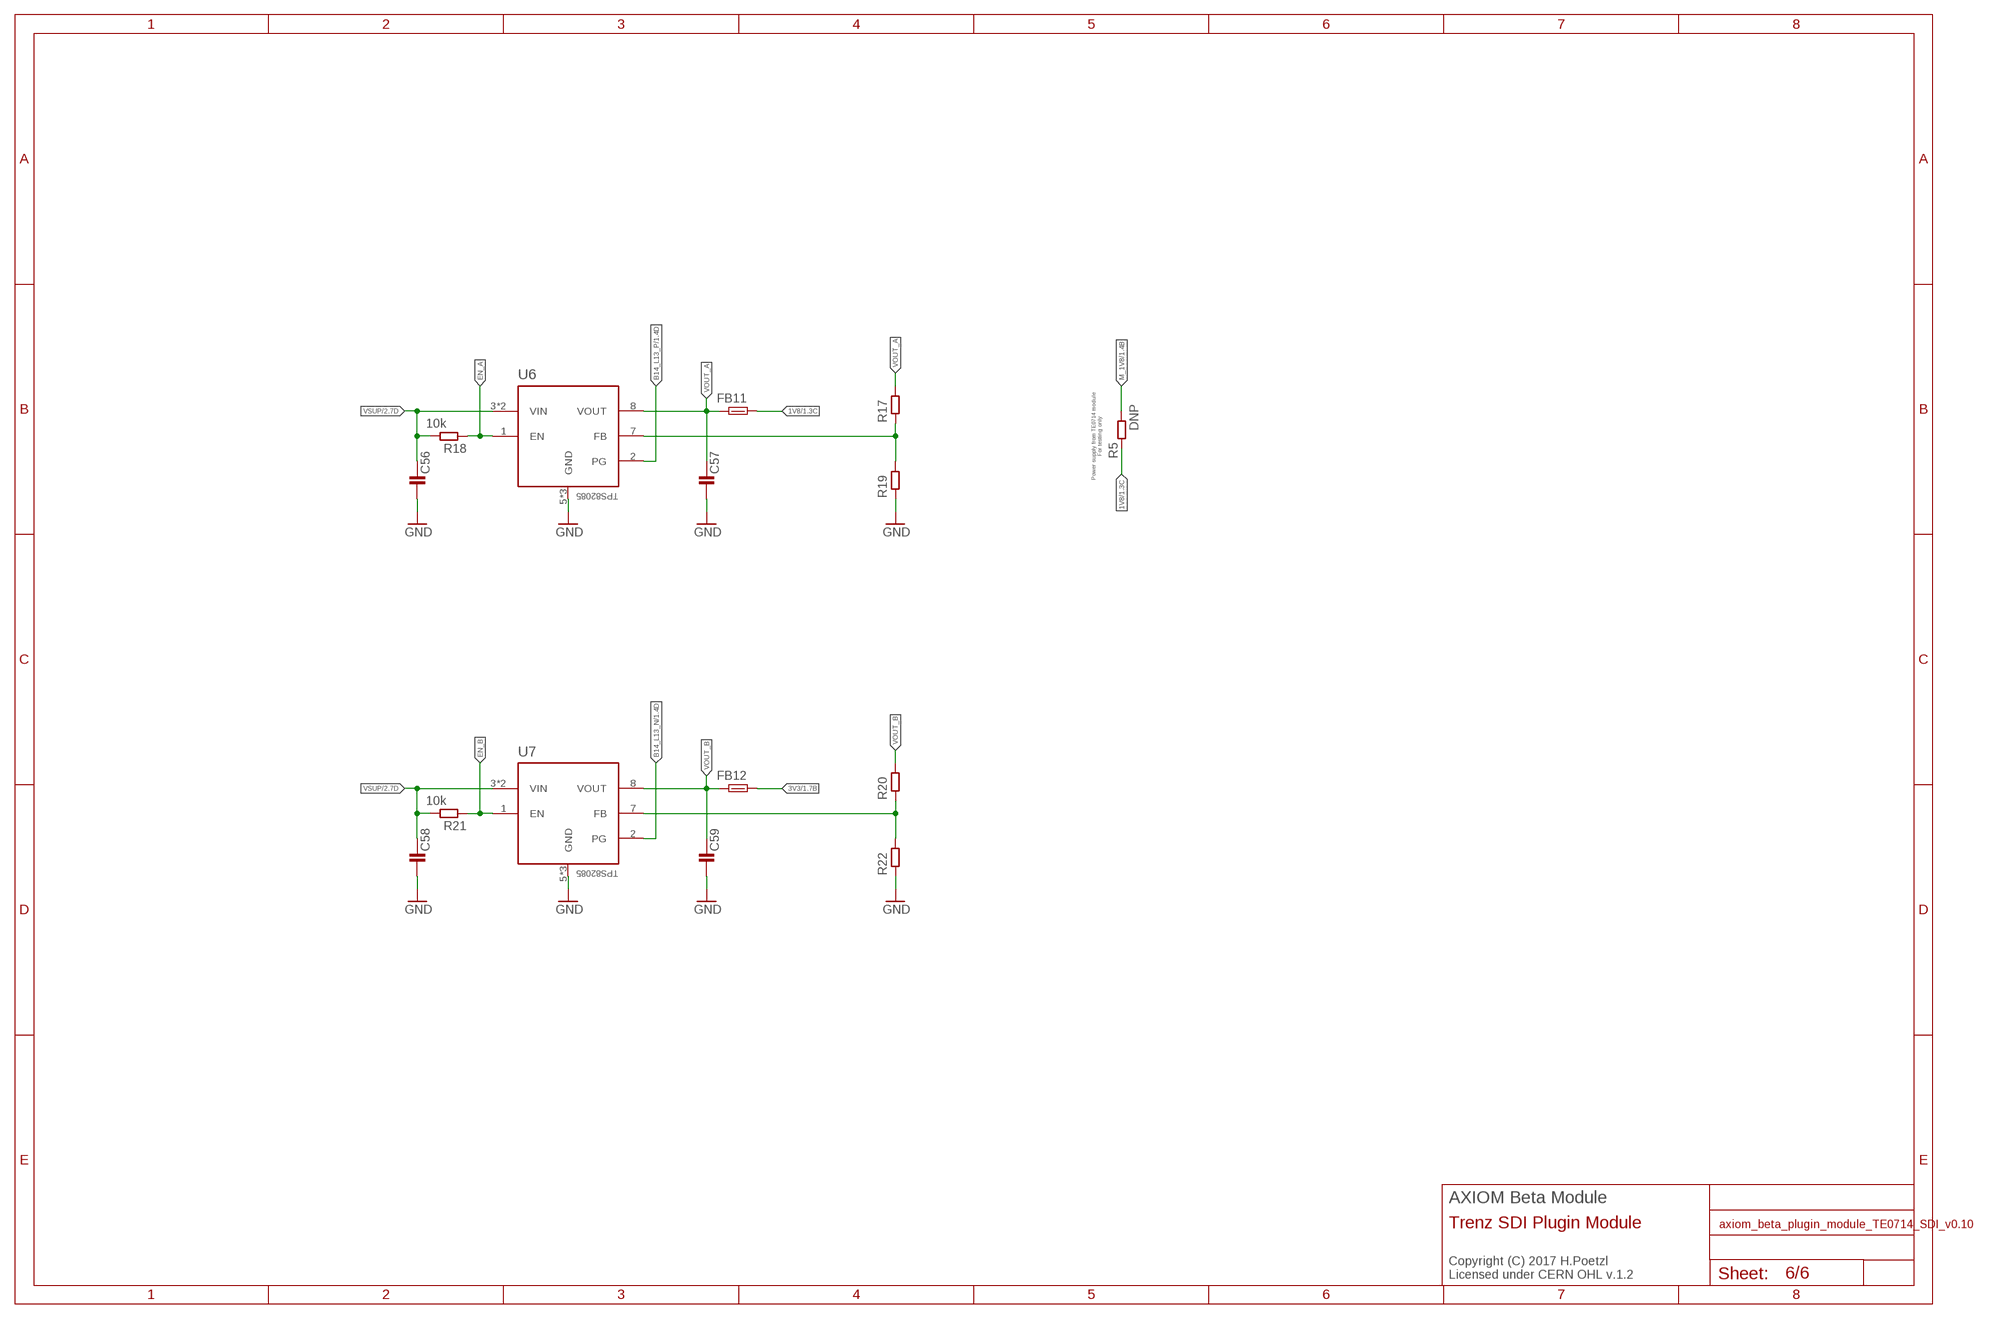
[diagram p5: schematic, sheet 6]

### Parts
C56  C0603-C  [0603-C]
C57  C0603-C  [0603-C]
C58  C0603-C  [0603-C]
C59  C0603-C  [0603-C]
FB11  FB0603-C  [0603-C]
FB12  FB0603-C  [0603-C]
R5  DNP  R0402-C  [0402-C]
R17  R0201-C  [0201-C]
R18  10k  R0201-C  [0201-C]
R19  R0201-C  [0201-C]
R20  R0201-C  [0201-C]
R21  10k  R0201-C  [0201-C]
R22  R0201-C  [0201-C]
U6  TPS82085  [MICROSIP]
U7  TPS82085  [MICROSIP]

### Nets
1V8 [LVDS]: FB11.2 R5.1 ; also sheet 1,3,4,5
3V3 [LVDS]: FB12.2 ; also sheet 1,2,4,5
B14_L13_N: U7.2(PG) ; also sheet 1
B14_L13_P: U6.2(PG) ; also sheet 1
EN_A: R18.1 U6.1(EN)
EN_B: R21.1 U7.1(EN)
FB_A: R17.1 R19.2 U6.7(FB)
FB_B: R20.1 R22.2 U7.7(FB)
GND: C56.2 C57.2 C58.2 C59.2 R19.1 R22.1 U6.5(GND) U6.6(GND) U6.EP(GND) U7.5(GND) U7.6(GND) U7.EP(GND) ; also sheet 1,2,3,4,5
M_1V8 [LVDS]: R5.2 ; also sheet 1
VOUT_A: C57.1 FB11.1 R17.2 U6.8(VOUT)
VOUT_B: C59.1 FB12.1 R20.2 U7.8(VOUT)
VSUP [LVDS]: C56.1 C58.1 R18.2 R21.2 U6.3(VIN) U6.4(VIN) U7.3(VIN) U7.4(VIN) ; also sheet 2

### Notes on the sheet
- Power supply from TE0714 module
  For testing only
- AXIOM Beta Module
- Trenz SDI Plugin Module
- Copyright (C) 2017 H.Poetzl
  Licensed under CERN OHL v.1.2

## Library data of the parts
C1-C59 = generic-rcl:C
D1-D5 = led:LED
FB1-FB12 = generic-rcl:FB
JM1 JM2 = LSHM-150-XX.X-XX-DV-A-S:LSHM-150-XX.X-XX-DV-A-S: 0.5MM TERMINAL/SOCKET COMBO. MANUFACTURER: SAMTEC.
JP1 = pinhead-2:PINHD-1X03: PIN HEADER
JTAG = pinhead-2:PINHD-2X07: PIN HEADER
OUT1 OUT2 SDI-IN = hdbnc:HDBNC
PCIE-NORTH PCIE-SOUTH = PCIe:PCIE-36-AXIOM
R1-R22 = generic-rcl:R
TP1-TP8 = testpad:TP: Test pad
U1 = dsc11xx:DSC11XX: DUAL-BIT DUAL-SUPPLY BUS TRANSCEIVER
U2 = eeprom:BR24G04
U3 = gs122xx:GS12241
U4 U5 = gs122xx:GS12281
U6 U7 = TPS82085:TPS82085: Buck/Boost Charge Pump 60mA

## Net classes
0 default: width 0.152 mm, drill 0.203 mm, clearance 0.152 mm
1 LVDS: width 0.152 mm, drill 0.203 mm, clearance 0.152 mm
2 75Ohm: width 0.178 mm, drill 0.203 mm, clearance 0.254 mm
3 MGT: width 0.152 mm, drill 0.203 mm, clearance 0.356 mm